# Altium project EasyARM-i.MX283-EV.PrjPcb (part 2 of 2)

## Sheet 10. TF Card.SchDoc
size A4; CheckedBy: 黄钦宁; Author: 陈坤; DocumentNumber: 10; SheetNumber: 10; SheetTotal: 13; PageSetup: Record=PageOptions|CenterHorizontal=True|CenterVertical=True|PrintScale=1.00|XCorrection=1.00|YCorrection=1.00|PrintKind=0|BorderSize=5000000|LeftOffset=0|BottomOffset=0|Orientation=2|PaperLength=1000|PaperWidth=1000|Scale=100|PaperSource=7|PrintQuality=600|MediaType=1|DitherType=10|PaperKind=A4|PrintScaleMode=1; DesignDate: 2013-08-16; CheckDate: 2013-12-28; SheetName: TF Card; SheetVersion: V1.00; SheetDescription: TF卡接口; ModifiedDate1: 2013-11-30; ModifiedContent1: 将上拉电阻改为分立电阻，方便调试; ProductName: EasyARM-iMX28学习套件; ProductModel: EasyARM-iMX283
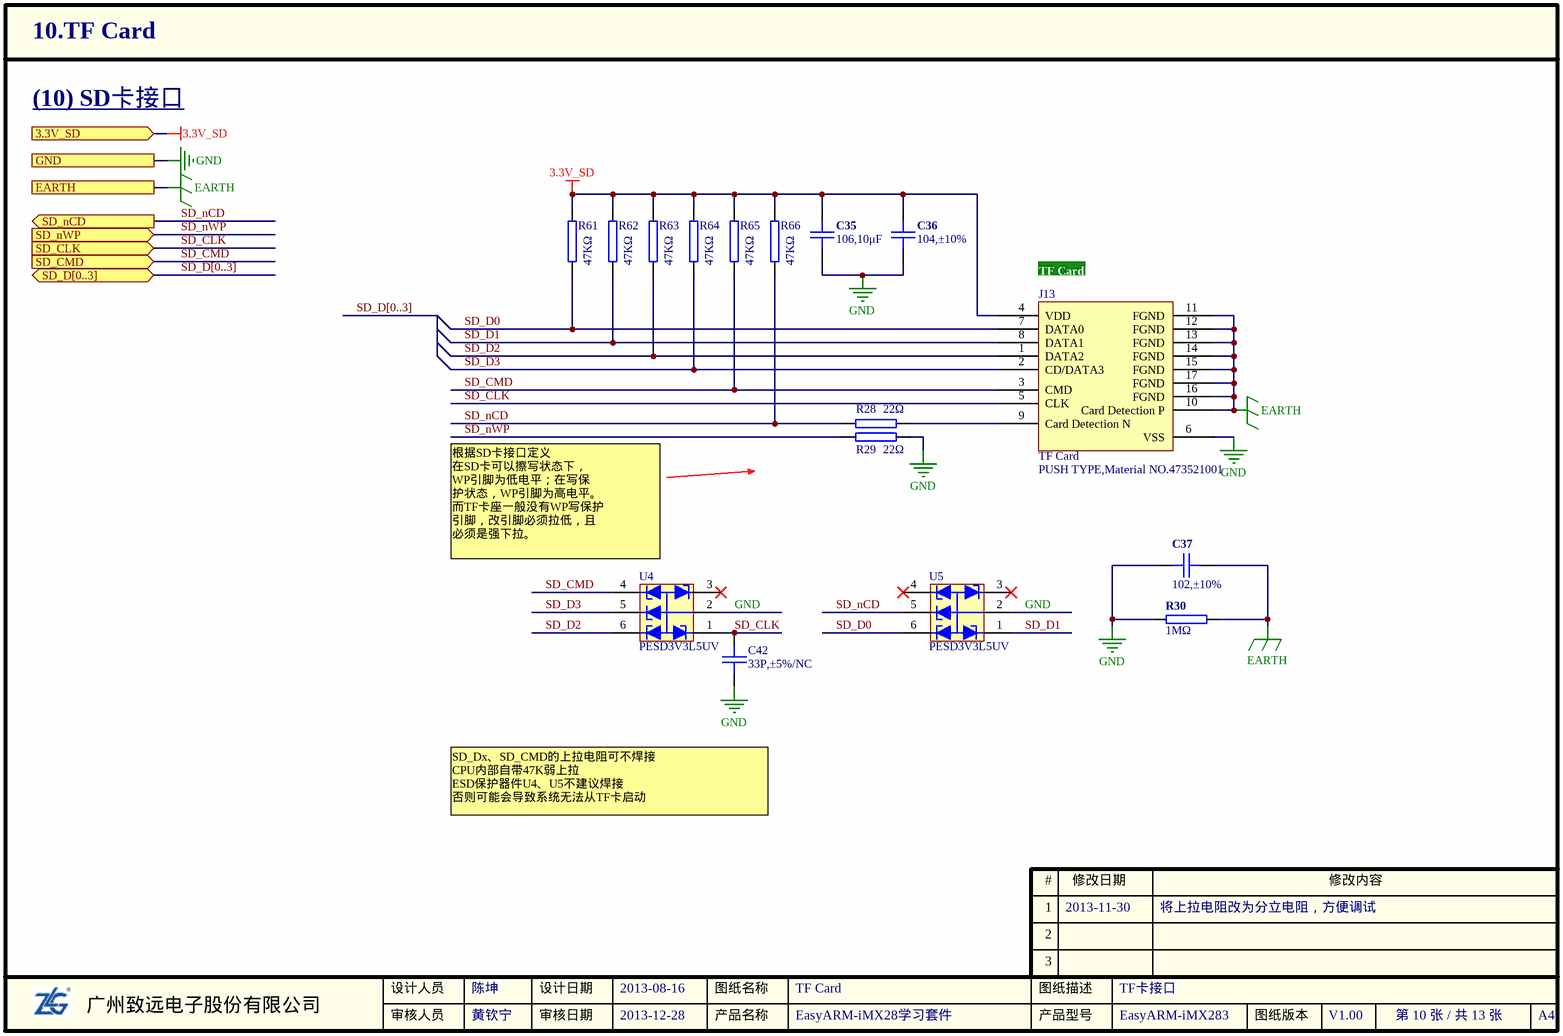
[diagram p7: 10. TF Card.SchDoc]

### Parts
C35  106,10μF  [0805C]
C36  104,±10%  [0603C]
C37  102,±10%  [1206C]
C42  33P,±5%/NC  [0603C]
J13  TF Card  value PUSH TYPE,Material NO.473521001  [TF-MOLEX_a]
R28  22Ω  [0603R]
R29  22Ω  [0603R]
R30  1MΩ  [1206R]
R61  47KΩ  [0603R]
R62  47KΩ  [0603R]
R63  47KΩ  [0603R]
R64  47KΩ  [0603R]
R65  47KΩ  [0603R]
R66  47KΩ  [0603R]
U4  value PESD3V3L5UV  [SOT-666]  (hidden comment: PESD5V0L5UV)
U5  value PESD3V3L5UV  [SOT-666]  (hidden comment: PESD5V0L5UV)

### Ports
3.3V_SD, EARTH, GND, SD_CLK (in), SD_CMD (in), SD_D[0..3] (bidir), SD_nCD (out), SD_nWP (in)

### Nets
3.3V_SD: C35.1 C36.1 J13.4(VDD) R61.2 R62.2 R63.2 R64.2 R65.2 R66.2 ; port 3.3V_SD  [project net 3.3V]
EARTH: C37.1 J13.10(Card_Detection_P) J13.11(FGND) J13.12(FGND) J13.13(FGND) J13.14(FGND) J13.15(FGND) J13.16(FGND) J13.17(FGND) R30.1 ; port EARTH
GND: C35.2 C36.2 C37.2 C42.2 J13.6(VSS) R29.1 R30.2 U4.2 U5.2 ; port GND
SD_CLK: C42.1 J13.5(CLK) U4.1 ; port SD_CLK
SD_CMD: J13.3(CMD) R65.1 U4.4 ; port SD_CMD
SD_D0: J13.7(DATA0) R61.1 U5.6
SD_D1: J13.8(DATA1) R62.1 U5.1
SD_D2: J13.1(DATA2) R63.1 U4.6
SD_D3: J13.2(CD/DATA3) R64.1 U4.5
SD_nCD: R28.1 R66.1 U5.5 ; port SD_nCD  [project net SD_DETECT]
SD_nWP: R29.2 ; port SD_nWP
NetJ13_9: J13.9(Card_Detection_N) R28.2

Not connected (* = marked no-connect by the designer): U4 3*; U5 3* 4*

### Buses and harness runs
bus SD_D[0..3]
bus SD_D[0..3] = port SD_D[0..3]

### Notes on the sheet
- (10) SD卡接口
- (near J13) TF Card
- (near U4) 根据SD卡接口定义
  在SD卡可以擦写状态下，
  WP引脚为低电平；在写保
  护状态，WP引脚为高电平。
  而TF卡座一般没有WP写保护
  引脚，改引脚必须拉低，且
  必须是强下拉。
- SD_Dx、SD_CMD的上拉电阻可不焊接
  CPU内部自带47K弱上拉
  ESD保护器件U4、U5不建议焊接
  否则可能会导致系统无法从TF卡启动
- 1
- #
- 修改日期
- 修改内容
- 2
- 3
- 广州致远电子股份有限公司
- 设计人员
- 审核人员
- 设计日期
- 审核日期
- 产品名称
- 图纸名称
- 产品型号
- 图纸描述
- 图纸版本
- A4

### Library data of the parts
C35 = 1.02.02.0055: as C43 on sheet 08. NET_DP83848K; 物料代码: 1.02.02.0055; Value: 106,10μF; RoHS: RoHS; 型号: 106,10μF,±10%,10V,X5R; ComponentLink1Description: ErpDataInfo; ComponentLink1URL: http://erp.zlgmcu.com/ErpExt/ErpData/ListMateriel.aspx?pkey=1.02.02.0055
C36 = 1.02.01.0032: as C12 on sheet 05. UART; 物料代码: 1.02.01.0032; Value: 104,±10%; RoHS: RoHS; 型号: 104,±10%,50V,X7R; ComponentLink1Description: ErpDataInfo; ComponentLink1URL: http://erp.zlgmcu.com/ErpExt/ErpData/ListMateriel.aspx?pkey=1.02.01.0032
C37 = 1.02.03.0003: Capacitor; 名称: 电容; 规格型号: 102,±10%,2KV,X7R,1206,*,RoHS; 现有库存: 26517; 封装: 1206; 设备封装名称: C1206_102_X7R_2KV_10%; 贴片和直插: SMT; 物料代码: 1.02.03.0003; Value: 102,±10%; ComponentLink1Description: ErpDataInfo; ComponentLink1URL: http://erp.zlgmcu.com/ErpExt/ErpData/ListMateriel.aspx?pkey=1.02.03.0003; RoHS: RoHS
C42 = 1.02.01.0045: 33P,±5%,50V,COG,0603,RoHS; 名称: 电容; 封装: 0603; 设备封装名称: C0603_33P_COG_50V_5%; 贴片和直插: SMT; 物料代码: 1.02.01.0045; Value: 33P,±5%/NC; RoHS: RoHS; 型号: 33P,±5%,50V,COG; ComponentLink1Description: ErpDataInfo; ComponentLink1URL: http://erp.zlgmcu.com/ErpExt/ErpData/ListMateriel.aspx?pkey=1.02.01.0045
J13 = 1.10.05.0147: PUSH TYPE,Material NO.473521001,15.2×14×1.88mm,molex,RoHS; 名称: TF卡座; 贴片和直插: SMT; 物料代码: 1.10.05.0147; 厂商: molex; RoHS: RoHS; 型号: PUSH TYPE,Material NO.473521001,15.2×14×1.88mm; ComponentLink1Description: ErpDataInfo; ComponentLink1URL: http://erp.zlgmcu.com/ErpExt/ErpData/ListMateriel.aspx?pkey=1.10.05.0147
R28 R29 = 1.01.01.0014: 名称: 电阻; 规格型号: 22Ω,0603,*,RoHS; 现有库存: 99098; 物料代码: 1.01.01.0014; Value: 22Ω; ComponentLink1Description: ErpDataInfo; ComponentLink1URL: http://192.168.0.2:8012/ErpExt/ErpData/ListMateriel.aspx?pkey=1.01.01.0014
R30 = 1.01.03.0019: 名称: 电阻; 规格型号: 1MΩ,1206,RoHS; 现有库存: 12252; 封装: 1206; 设备封装名称: R1206_1M; 贴片和直插: SMT; 物料代码: 1.01.03.0019; Value: 1MΩ; ComponentLink1Description: ErpDataInfo; ComponentLink1URL: http://erp.zlgmcu.com/ErpExt/ErpData/ListMateriel.aspx?pkey=1.01.03.0019; RoHS: RoHS
R61-R66 = 1.01.01.0060: 47KΩ,0603,*,RoHS; 名称: 电阻; 封装: 0603; 设备封装名称: R0603_47K; 贴片和直插: SMT; 物料代码: 1.01.01.0060; Value: 47KΩ; RoHS: RoHS; 型号: 47KΩ; ComponentLink1Description: ErpDataInfo; ComponentLink1URL: http://erp.zlgmcu.com/ErpExt/ErpData/ListMateriel.aspx?pkey=1.01.01.0060
U4 U5 = 1.05.10.0315: PESD3V3L5UV,SOT-666,NXP,RoHS; 名称: IC; 设备封装名称: SOT-666_PESD3V3L5UV; 贴片和直插: SMT; 物料代码: 1.05.10.0315; 封装: SOT-666; 厂商: NXP; RoHS: RoHS; 型号: PESD3V3L5UV; ComponentLink1Description: ErpDataInfo; ComponentLink1URL: http://erp.zlgmcu.com/ErpExt/ErpData/ListMateriel.aspx?pkey=1.05.10.0315

## Sheet 11. LCD.SchDoc
size A4; CheckedBy: 黄钦宁; Author: 陈坤; DocumentNumber: 11; SheetNumber: 11; SheetTotal: 13; PageSetup: Record=PageOptions|CenterHorizontal=True|CenterVertical=True|PrintScale=1.00|XCorrection=1.00|YCorrection=1.00|PrintKind=0|BorderSize=5000000|LeftOffset=0|BottomOffset=0|Orientation=2|PaperLength=1000|PaperWidth=1000|Scale=100|PaperSource=7|PrintQuality=600|MediaType=1|DitherType=10|PaperKind=A4|PrintScaleMode=1; DesignDate: 2013-08-16; CheckDate: 2013-12-28; SheetName: LCD; SheetVersion: V1.00; SheetDescription: 液晶屏接口; ProductName: EasyARM-iMX28学习套件; ProductModel: EasyARM-iMX283
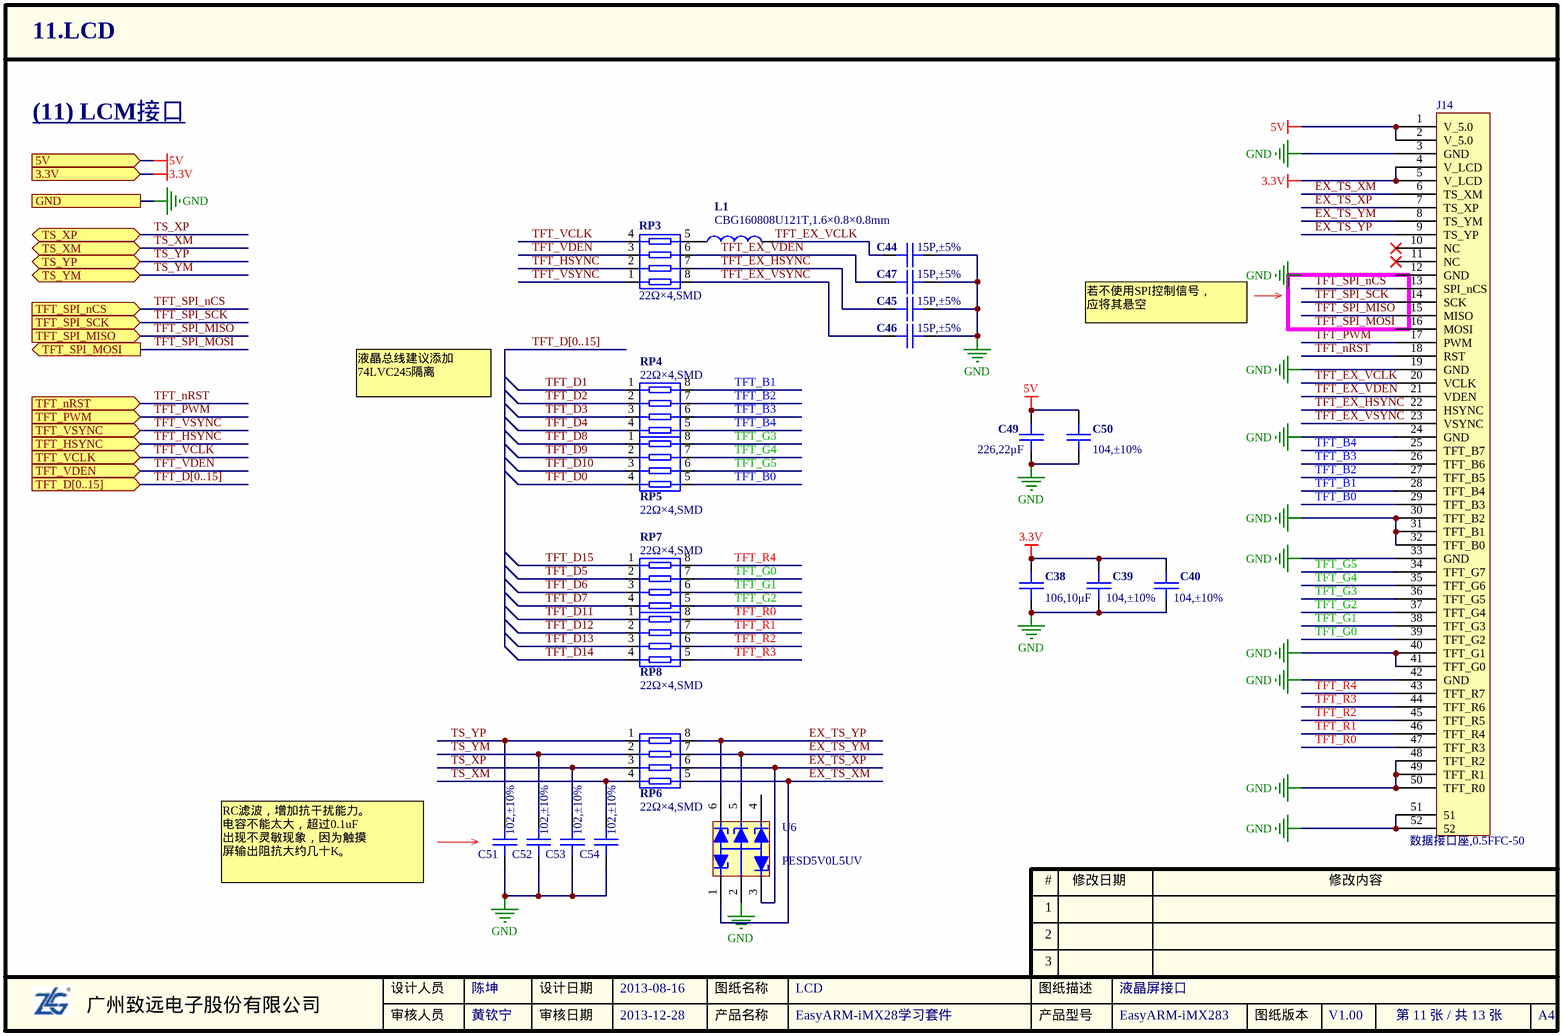
[diagram p8: 11. LCD.SchDoc]

### Parts
C38  106,10μF  [0805C]
C39  104,±10%  [0603C]
C40  104,±10%  [0603C]
C44  15P,±5%  [0603C]
C45  15P,±5%  [0603C]
C46  15P,±5%  [0603C]
C47  15P,±5%  [0603C]
C49  226,22μF  [0805C]
C50  104,±10%  [0603C]
C51  102,±10%  [0603C]
C52  102,±10%  [0603C]
C53  102,±10%  [0603C]
C54  102,±10%  [0603C]
J14  value 数据接口座,0.5FFC-50  [FFC0.5-50P-A]  (hidden comment: FPC-50)
L1  value CBG160808U121T,1.6×0.8×0.8mm  [0603R]  (hidden comment: INDUCTOR1)
RP3  22Ω×4,SMD  [0603RA]
RP4  22Ω×4,SMD  [0603RA]
RP5  22Ω×4,SMD  [0603RA]
RP6  22Ω×4,SMD  [0603RA]
RP7  22Ω×4,SMD  [0603RA]
RP8  22Ω×4,SMD  [0603RA]
U6  PESD5V0L5UV  [SOT-666]

### Ports
3.3V, 5V, GND, TFT_D[0..15] (in), TFT_HSYNC (in), TFT_nRST (in), TFT_PWM (in), TFT_SPI_MISO (in), TFT_SPI_MOSI (out), TFT_SPI_nCS (in), TFT_SPI_SCK (in), TFT_VCLK (in), TFT_VDEN (in), TFT_VSYNC (in), TS_XM (bidir), TS_XP (bidir), TS_YM (bidir), TS_YP (bidir)

### Nets
3.3V: C38.1 C39.1 C40.1 J14.4(V_LCD) J14.5(V_LCD) ; port 3.3V
5V: C49.1 C50.1 J14.1(V_5.0) J14.2(V_5.0) ; port 5V
GND: C38.2 C39.2 C40.2 C44.2 C45.2 C46.2 C47.2 C49.2 C50.2 C51.2 C52.2 C53.2 C54.2 J14.3(GND) J14.12(GND) J14.19(GND) J14.24(GND) J14.30(TFT_B2) J14.31(TFT_B1) J14.32(TFT_B0) J14.33(GND) J14.40(TFT_G1) J14.41(TFT_G0) J14.42(GND) J14.48(TFT_R2) J14.49(TFT_R1) J14.50(TFT_R0) J14.51 J14.52 U6.2 ; port GND
EX_TS_XM: J14.6(TS_XM) RP6.5 U6.1
EX_TS_XP: J14.7(TS_XP) RP6.6 U6.3
EX_TS_YM: J14.8(TS_YM) RP6.7 U6.5
EX_TS_YP: J14.9(TS_YP) RP6.8 U6.6
TFT_B0: J14.29(TFT_B3) RP5.5
TFT_B1: J14.28(TFT_B4) RP4.8
TFT_B2: J14.27(TFT_B5) RP4.7
TFT_B3: J14.26(TFT_B6) RP4.6
TFT_B4: J14.25(TFT_B7) RP4.5
TFT_D0: RP5.4
TFT_D1: RP4.1
TFT_D2: RP4.2
TFT_D3: RP4.3
TFT_D4: RP4.4
TFT_D5: RP7.2
TFT_D6: RP7.3
TFT_D7: RP7.4
TFT_D8: RP5.1
TFT_D9: RP5.2
TFT_D10: RP5.3
TFT_D11: RP8.1
TFT_D12: RP8.2
TFT_D13: RP8.3
TFT_D14: RP8.4
TFT_D15: RP7.1
TFT_EX_HSYNC: C45.1 J14.22(HSYNC) RP3.7
TFT_EX_VCLK: C44.1 J14.20(VCLK) L1.2
TFT_EX_VDEN: C47.1 J14.21(VDEN) RP3.6
TFT_EX_VSYNC: C46.1 J14.23(VSYNC) RP3.8
TFT_G0: J14.39(TFT_G2) RP7.7
TFT_G1: J14.38(TFT_G3) RP7.6
TFT_G2: J14.37(TFT_G4) RP7.5
TFT_G3: J14.36(TFT_G5) RP5.8
TFT_G4: J14.35(TFT_G6) RP5.7
TFT_G5: J14.34(TFT_G7) RP5.6
TFT_HSYNC: RP3.2 ; port TFT_HSYNC
TFT_nRST: J14.18(RST) ; port TFT_nRST
TFT_PWM: J14.17(PWM) ; port TFT_PWM
TFT_R0: J14.47(TFT_R3) RP8.8
TFT_R1: J14.46(TFT_R4) RP8.7
TFT_R2: J14.45(TFT_R5) RP8.6
TFT_R3: J14.44(TFT_R6) RP8.5
TFT_R4: J14.43(TFT_R7) RP7.8
TFT_SPI_MISO: J14.15(MISO) ; port TFT_SPI_MISO
TFT_SPI_MOSI: J14.16(MOSI) ; port TFT_SPI_MOSI
TFT_SPI_nCS: J14.13(SPI_nCS) ; port TFT_SPI_nCS
TFT_SPI_SCK: J14.14(SCK) ; port TFT_SPI_SCK
TFT_VCLK: RP3.4 ; port TFT_VCLK
TFT_VDEN: RP3.3 ; port TFT_VDEN
TFT_VSYNC: RP3.1 ; port TFT_VSYNC
TS_XM: C54.1 RP6.4 ; port TS_XM
TS_XP: C53.1 RP6.3 ; port TS_XP
TS_YM: C52.1 RP6.2 ; port TS_YM
TS_YP: C51.1 RP6.1 ; port TS_YP
NetL1_1: L1.1 RP3.5

Not connected (* = marked no-connect by the designer): J14 10(NC)* 11(NC)*; U6 4

### Buses and harness runs
bus TFT_D[0..15]
bus TFT_D[0..15] = port TFT_D[0..15]

### Notes on the sheet
- (11) LCM接口
- 若不使用SPI控制信号，
  应将其悬空
- 液晶总线建议添加
  74LVC245隔离
- RC滤波，增加抗干扰能力。
  电容不能太大，超过0.1uF
  出现不灵敏现象，因为触摸
  屏输出阻抗大约几十K。
- 1
- #
- 修改日期
- 修改内容
- 2
- 3
- 广州致远电子股份有限公司
- 设计人员
- 审核人员
- 设计日期
- 审核日期
- 产品名称
- 图纸名称
- 产品型号
- 图纸描述
- 图纸版本
- A4

### Library data of the parts
C38 = 1.02.02.0055: as C43 on sheet 08. NET_DP83848K; 物料代码: 1.02.02.0055; Value: 106,10μF; RoHS: RoHS; 型号: 106,10μF,±10%,10V,X5R; ComponentLink1Description: ErpDataInfo; ComponentLink1URL: http://erp.zlgmcu.com/ErpExt/ErpData/ListMateriel.aspx?pkey=1.02.02.0055
C39 C40 C50 = 1.02.01.0032: as C12 on sheet 05. UART; 物料代码: 1.02.01.0032; Value: 104,±10%; RoHS: RoHS; 型号: 104,±10%,50V,X7R; ComponentLink1Description: ErpDataInfo; ComponentLink1URL: http://erp.zlgmcu.com/ErpExt/ErpData/ListMateriel.aspx?pkey=1.02.01.0032
C44-C47 = 1.02.01.0002: 15P,±5%,50V,COG,0603,*,RoHS; 名称: 电容; 封装: 0603; 设备封装名称: C0603_15P_COG_50V_5%; 贴片和直插: SMT; 物料代码: 1.02.01.0002; Value: 15P,±5%; RoHS: RoHS; 型号: 15P,±5%,50V,COG; ComponentLink1Description: ErpDataInfo; ComponentLink1URL: http://erp.zlgmcu.com/ErpExt/ErpData/ListMateriel.aspx?pkey=1.02.01.0002
C49 = 1.02.02.0059: as C64 on sheet 08. NET_DP83848K; 物料代码: 1.02.02.0059; Value: 226,22μF; RoHS: RoHS; 型号: 226,22μF,±20%,6.3V,X5R; ComponentLink1Description: ErpDataInfo; ComponentLink1URL: http://erp.zlgmcu.com/ErpExt/ErpData/ListMateriel.aspx?pkey=1.02.02.0059
C51-C54 = 1.02.01.0020: 102,±10%,50V,X7R,0603,*,RoHS; 名称: 电容; 封装: 0603; 设备封装名称: C0603_102_X7R_50V_10%; 贴片和直插: SMT; 物料代码: 1.02.01.0020; Value: 102,±10%; RoHS: RoHS; 型号: 102,±10%,50V,X7R; ComponentLink1Description: ErpDataInfo; ComponentLink1URL: http://erp.zlgmcu.com/ErpExt/ErpData/ListMateriel.aspx?pkey=1.02.01.0020
J14 = 1.10.01.0028: 数据接口座,0.5FFC-50,SMD,下接,RoHS; 名称: 连接器-SMD; 贴片和直插: SMT; 物料代码: 1.10.01.0028; RoHS: RoHS; 型号: 数据接口座,0.5FFC-50,SMD,下接; ComponentLink1Description: ErpDataInfo; ComponentLink1URL: http://erp.zlgmcu.com/ErpExt/ErpData/ListMateriel.aspx?pkey=1.10.01.0028
L1 = 1.03.03.0007: CBG160808U121T,1.6×0.8×0.8mm,0603,RoHS; 名称: 磁珠; 封装: 0603; 设备封装名称: FB0603_121T; 贴片和直插: SMT; 物料代码: 1.03.03.0007; RoHS: RoHS; 型号: CBG160808U121T,1.6×0.8×0.8mm; ComponentLink1Description: ErpDataInfo; ComponentLink1URL: http://erp.zlgmcu.com/ErpExt/ErpData/ListMateriel.aspx?pkey=1.03.03.0007
RP3-RP8 = 1.01.04.0001: 名称: 网络电阻; 规格型号: 22Ω×4,SMD,PZ-4-0.8,RoHS; 现有库存: 85384; 封装: PZ-4-0.8; 设备封装名称: 22R_4_0603; 贴片和直插: SMT; 物料代码: 1.01.04.0001; Value: 22Ω×4,SMD; ComponentLink1Description: ErpDataInfo; ComponentLink1URL: http://erp.zlgmcu.com/ErpExt/ErpData/ListMateriel.aspx?pkey=1.01.04.0001; RoHS: RoHS
U6 = 1.05.10.0189: PESD5V0L5UV,SOT-666,NXP,RoHS; 名称: IC; 设备封装名称: SOT-666_PESD5V0L5UV; 贴片和直插: SMT; 物料代码: 1.05.10.0189; Value: PESD5V0L5UV; 封装: SOT-666; 厂商: NXP; RoHS: RoHS; 型号: PESD5V0L5UV; ComponentLink1Description: ErpDataInfo; ComponentLink1URL: http://erp.zlgmcu.com/ErpExt/ErpData/ListMateriel.aspx?pkey=1.05.10.0189

## Sheet 03. Power.SchDoc
size A4; CheckedBy: 黄钦宁; Author: 陈坤; DocumentNumber: 3; SheetNumber: 3; SheetTotal: 13; PageSetup: Record=PageOptions|CenterHorizontal=True|CenterVertical=True|PrintScale=1.00|XCorrection=1.00|YCorrection=1.00|PrintKind=0|BorderSize=5000000|LeftOffset=0|BottomOffset=0|Orientation=2|PaperLength=1000|PaperWidth=1000|Scale=100|PaperSource=7|PrintQuality=600|MediaType=1|DitherType=10|PaperKind=A4|PrintScaleMode=1; DesignDate: 2013-08-16; CheckDate: 2013-12-28; SheetName: Power; SheetVersion: V1.00; SheetDescription: 评估板电源，包括1路5V，1路3.3V; ProductModel: EasyARM-iMX283; ProductName: EasyARM-iMX28学习套件
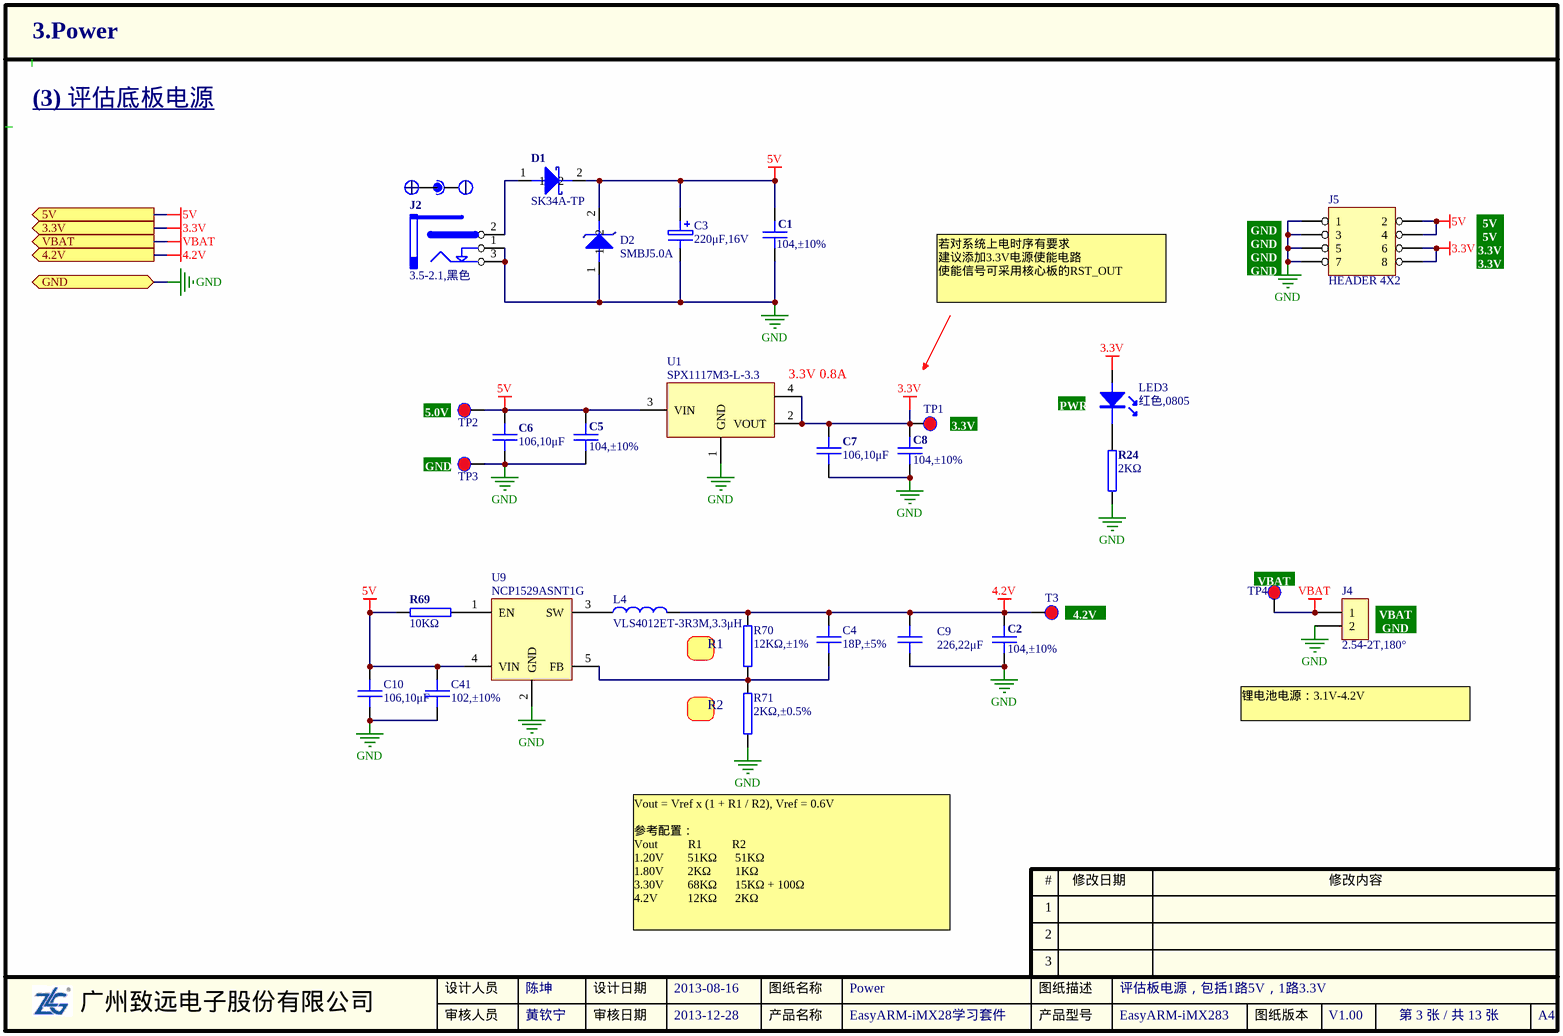
[diagram p9: 03. Power.SchDoc]

### Parts
C1  104,±10%  [0603C]
C2  104,±10%  [0603C]
C3  220μF,16V  [RB-.1/.25]
C4  18P,±5%  [0603C]
C5  104,±10%  [0603C]
C6  106,10μF  [0805C]
C7  106,10μF  [0805C]
C8  104,±10%  [0603C]
C9  226,22μF  [0805C]
C10  106,10μF  [0805C]
C41  102,±10%  [0603C]
D1  value SK34A-TP  [SOD-SK34A]  (hidden comment: DIODE SCHOTTKY)
D2  value SMBJ5.0A  [1812D]  (hidden comment: DIODE ZENER)
J2  value 3.5-2.1,黑色  [POWER-AC]  (hidden comment: POWER-COM)
J4  value 2.54-2T,180°  [CN-2-2.54]  (hidden comment: CON2)
J5  HEADER 4X2  [IDC-8]
L4  value VLS4012ET-3R3M,3.3μH  [L-4.0S-VLS]  (hidden comment: INDUCTOR1)
LED3  value 红色,0805  [LED-0805]  (hidden comment: LED1)
R24  2KΩ  [0603R]
R69  10KΩ  [0603R]
R70  12KΩ,±1%  [0603R]
R71  2KΩ,±0.5%  [0603R]
T3  4.2V  [PAD-40]  (value not drawn)
TP1  3.3V  [PAD-40]  (value not drawn)
TP2  5.0V  [PAD-40]  (value not drawn)
TP3  GND  [PAD-40]  (value not drawn)
TP4  VBAT  [PAD-40]  (value not drawn)
U1  value SPX1117M3-L-3.3  [SOT-223]  (hidden comment: SPX1117M3-L/TR)
U9  value NCP1529ASNT1G  [SOT-23-5]  (hidden comment: SCY99090SNT1G)

### Ports
3.3V, 4.2V (out), 5V (out), GND, VBAT (out)

### Nets
3.3V: C7.1 C8.1 J5.6 J5.8 LED3.1 TP1.1 U1.2(VOUT) U1.4 ; port 3.3V
4.2V: C2.1 C4.1 C9.1 L4.2 R70.2 T3.1 ; port 4.2V
5V: C1.1 C3.1 C5.1 C6.1 C10.1 C41.1 D1.2 D2.2 J5.2 J5.4 R69.1 TP2.1 U1.3(VIN) U9.4(VIN) ; port 5V
GND: C1.2 C2.2 C3.2 C5.2 C6.2 C7.2 C8.2 C9.2 C10.2 C41.2 D2.1 J2.1(A) J2.3(B) J4.2 J5.1 J5.3 J5.5 J5.7 R24.1 R71.1 TP3.1 U1.1(GND) U9.2(GND) ; port GND
VBAT: J4.1 TP4.1 ; port VBAT
NetC4_2: C4.2 R70.1 R71.2 U9.5(FB)
NetD1_1: D1.1 J2.2(B)
NetL4_1: L4.1 U9.3(SW)
NetLED3_2: LED3.2 R24.2
NetR69_2: R69.2 U9.1(EN)

### Notes on the sheet
- (3) 评估底板电源
- (near J5) GND
- 5V
- 3.3V
- 若对系统上电时序有要求
  建议添加3.3V电源使能电路
  使能信号可采用核心板的RST_OUT
- (near U1) 3.3V 0.8A
- (near TP2) 5.0V
- (near LED3) PWR
- (near TP3) GND
- (near TP4) VBAT
- R1
- (near T3) 4.2V
- (near J4) VBAT
- (near J4) GND
- R2
- 锂电池电源：3.1V-4.2V
- Vout = Vref x (1 + R1 / R2), Vref = 0.6V
  参考配置：
  Vout          R1          R2
  1.20V        51KΩ      51KΩ
  1.80V        2KΩ        1KΩ
  3.30V        68KΩ      15KΩ + 100Ω
  4.2V          12KΩ      2KΩ
- 1
- #
- 修改日期
- 修改内容
- 2
- 3
- 广州致远电子股份有限公司
- 设计人员
- 审核人员
- 设计日期
- 审核日期
- 产品名称
- 图纸名称
- 产品型号
- 图纸描述
- 图纸版本
- A4

### Library data of the parts
C1 C2 C5 C8 = 1.02.01.0032: 104,±10%,50V,X7R,0603,*,RoHS; 名称: 电容; 封装: 0603; 设备封装名称: C0603_104_X7R_50V_10%; 贴片和直插: SMT; 器件优选方案: 优先选用; 物料代码: 1.02.01.0032; Value: 104,±10%; RoHS: RoHS; 型号: 104,±10%,50V,X7R; ComponentLink1Description: ErpDataInfo; ComponentLink1URL: http://erp.zlgmcu.com/ErpExt/ErpData/ListMateriel.aspx?pkey=1.02.01.0032
C3 = 1.02.11.0018: 220μF,16V,Ф6.3×7mm,,珠海华冠,RoHS; 名称: 电解电容; 贴片和直插: THT; 物料代码: 1.02.11.0018; Value: 220μF,16V; 厂商: 珠海华冠; RoHS: RoHS; 型号: 220μF,16V,Ф6.3×7mm; ComponentLink1Description: ErpDataInfo; ComponentLink1URL: http://erp.zlgmcu.com/ErpExt/ErpData/ListMateriel.aspx?pkey=1.02.11.0018
C4 = 1.02.01.0003: 18P,±5%,50V,COG,0603,*,RoHS; 名称: 电容; 封装: 0603; 设备封装名称: C0603_18P_COG_50V_5%; 贴片和直插: SMT; 物料代码: 1.02.01.0003; Value: 18P,±5%; RoHS: RoHS; 型号: 18P,±5%,50V,COG; ComponentLink1Description: ErpDataInfo; ComponentLink1URL: http://erp.zlgmcu.com/ErpExt/ErpData/ListMateriel.aspx?pkey=1.02.01.0003
C6 C7 C10 = 1.02.02.0055: 106,10μF,±10%,10V,X5R,0805,RoHS; 名称: 电容; 封装: 0805; 设备封装名称: C0805_106_X5R_10V_10%; 贴片和直插: SMT; 物料代码: 1.02.02.0055; Value: 106,10μF; RoHS: RoHS; 型号: 106,10μF,±10%,10V,X5R; ComponentLink1Description: ErpDataInfo; ComponentLink1URL: http://erp.zlgmcu.com/ErpExt/ErpData/ListMateriel.aspx?pkey=1.02.02.0055
C9 = 1.02.02.0059: 226,22μF,±20%,6.3V,X5R,0805,RoHS; 名称: 电容; 封装: 0805; 设备封装名称: C0805_226_X5R_6.3V_20%; 贴片和直插: SMT; 物料代码: 1.02.02.0059; Value: 226,22μF; RoHS: RoHS; 型号: 226,22μF,±20%,6.3V,X5R; ComponentLink1Description: ErpDataInfo; ComponentLink1URL: http://erp.zlgmcu.com/ErpExt/ErpData/ListMateriel.aspx?pkey=1.02.02.0059
C41 = 1.02.01.0020: 102,±10%,50V,X7R,0603,*,RoHS; 名称: 电容; 封装: 0603; 设备封装名称: C0603_102_X7R_50V_10%; 贴片和直插: SMT; 物料代码: 1.02.01.0020; Value: 102,±10%; RoHS: RoHS; 型号: 102,±10%,50V,X7R; ComponentLink1Description: ErpDataInfo; ComponentLink1URL: http://erp.zlgmcu.com/ErpExt/ErpData/ListMateriel.aspx?pkey=1.02.01.0020
D1 = 1.04.07.0021: SK34A-TP,DO-214AC,MCC,RoHS; 名称: 二极管; 设备封装名称: DO-214AC_SK34A; 贴片和直插: SMT; 物料代码: 1.04.07.0021; 封装: DO-214AC; 厂商: MCC; RoHS: RoHS; 型号: SK34A-TP; ComponentLink1Description: ErpDataInfo; ComponentLink1URL: http://erp.zlgmcu.com/ErpExt/ErpData/ListMateriel.aspx?pkey=1.04.07.0021
D2 = 1.04.03.0001: SMBJ5.0A,DO-214AA,君耀,RoHS; 名称: TVS管; 设备封装名称: DO-214AA_SMBJ5.0A; 贴片和直插: SMT; 器件优选方案: 优先选用; 物料代码: 1.04.03.0001; 封装: DO-214AA; 厂商: 君耀; RoHS: RoHS; 型号: SMBJ5.0A; ComponentLink1Description: ErpDataInfo; ComponentLink1URL: http://erp.zlgmcu.com/ErpExt/ErpData/ListMateriel.aspx?pkey=1.04.03.0001
J2 = 1.10.05.0001: 3.5-2.1,黑色,RoHS; 名称: 电源座; 贴片和直插: THT; 物料代码: 1.10.05.0001; RoHS: RoHS; 型号: 3.5-2.1,黑色; ComponentLink1Description: ErpDataInfo; ComponentLink1URL: http://erp.zlgmcu.com/ErpExt/ErpData/ListMateriel.aspx?pkey=1.10.05.0001
J4 = 1.10.06.0009: 2.54-2T,180°,,*; 名称: 插座; 贴片和直插: THT; 物料代码: 1.10.06.0009; 型号: 2.54-2T,180°; ComponentLink1Description: ErpDataInfo; ComponentLink1URL: http://erp.zlgmcu.com/ErpExt/ErpData/ListMateriel.aspx?pkey=1.10.06.0009
L4 = 1.03.01.0155: VLS4012ET-3R3M,3.3μH,1.4A,SMD,TDK,RoHS; 名称: 电感; 贴片和直插: SMT; 物料代码: 1.03.01.0155; 封装: SMD; 厂商: TDK; RoHS: RoHS; 型号: VLS4012ET-3R3M,3.3μH,1.4A; ComponentLink1Description: ErpDataInfo; ComponentLink1URL: http://erp.zlgmcu.com/ErpExt/ErpData/ListMateriel.aspx?pkey=1.03.01.0155
LED3 = 1.04.05.0001: 红色,0805,0805,RoHS; 名称: 发光二极管; 封装: 0805; 设备封装名称: LED0805-RED; 贴片和直插: SMT; 器件优选方案: 优先选用; 物料代码: 1.04.05.0001; RoHS: RoHS; 型号: 红色,0805; ComponentLink1Description: ErpDataInfo; ComponentLink1URL: http://erp.zlgmcu.com/ErpExt/ErpData/ListMateriel.aspx?pkey=1.04.05.0001
R24 = 1.01.01.0038: 2KΩ,0603,*,RoHS; 名称: 电阻; 封装: 0603; 设备封装名称: R0603_2K; 贴片和直插: SMT; 物料代码: 1.01.01.0038; Value: 2KΩ; RoHS: RoHS; 型号: 2KΩ; ComponentLink1Description: ErpDataInfo; ComponentLink1URL: http://erp.zlgmcu.com/ErpExt/ErpData/ListMateriel.aspx?pkey=1.01.01.0038
R69 = 1.01.01.0051: 10KΩ,0603,*,RoHS; 名称: 电阻; 封装: 0603; 设备封装名称: R0603_10K; 贴片和直插: SMT; 物料代码: 1.01.01.0051; Value: 10KΩ; RoHS: RoHS; 型号: 10KΩ; ComponentLink1Description: ErpDataInfo; ComponentLink1URL: http://erp.zlgmcu.com/ErpExt/ErpData/ListMateriel.aspx?pkey=1.01.01.0051
R70 = 1.01.01.0053: 12KΩ,±1%,0603,*,RoHS; 名称: 电阻; 封装: 0603; 设备封装名称: R0603_12K_1%; 贴片和直插: SMT; 物料代码: 1.01.01.0053; Value: 12KΩ,±1%; RoHS: RoHS; 型号: 12KΩ,±1%; ComponentLink1Description: ErpDataInfo; ComponentLink1URL: http://erp.zlgmcu.com/ErpExt/ErpData/ListMateriel.aspx?pkey=1.01.01.0053
R71 = 1.01.01.0084: 2KΩ,±0.5%,0603,*,RoHS; 名称: 电阻; 封装: 0603; 设备封装名称: R0603_2K_0.5%; 贴片和直插: SMT; 物料代码: 1.01.01.0084; Value: 2KΩ,±0.5%; RoHS: RoHS; 型号: 2KΩ,±0.5%; ComponentLink1Description: ErpDataInfo; ComponentLink1URL: http://erp.zlgmcu.com/ErpExt/ErpData/ListMateriel.aspx?pkey=1.01.01.0084
T3 TP1-TP4 = TEST-DOT
U1 = 1.05.09.0025: SPX1117M3-L-3.3,SOT-223,EXAR,RoHS; 名称: IC; 设备封装名称: SOT-223_SPX1117M3-L-3.3; 贴片和直插: SMT; 物料代码: 1.05.09.0025; 封装: SOT-223; 厂商: EXAR; RoHS: RoHS; 型号: SPX1117M3-L-3.3; ComponentLink1Description: ErpDataInfo; ComponentLink1URL: http://erp.zlgmcu.com/ErpExt/ErpData/ListMateriel.aspx?pkey=1.05.09.0025
U9 = 1.05.09.0091: NCP1529ASNT1G,TSOP-5,ON,RoHS; 名称: IC; 设备封装名称: TSOP-5_NCP1529ASNT1G; 贴片和直插: SMT; 物料代码: 1.05.09.0091; 封装: TSOP-5; 厂商: ON; RoHS: RoHS; 型号: NCP1529ASNT1G; ComponentLink1Description: ErpDataInfo; ComponentLink1URL: http://erp.zlgmcu.com/ErpExt/ErpData/ListMateriel.aspx?pkey=1.05.09.0091

## Sheet 13. Others.SchDoc
size A4; CheckedBy: 黄钦宁; Author: 陈坤; DocumentNumber: 13; SheetNumber: 13; SheetTotal: 13; PageSetup: Record=PageOptions|CenterHorizontal=True|CenterVertical=True|PrintScale=1.00|XCorrection=1.00|YCorrection=1.00|PrintKind=0|BorderSize=5000000|LeftOffset=0|BottomOffset=0|Orientation=2|PaperLength=1000|PaperWidth=1000|Scale=100|PaperSource=7|PrintQuality=600|MediaType=1|DitherType=10|PaperKind=A4|PrintScaleMode=1; DesignDate: 2013-08-16; CheckDate: 2013-12-28; SheetName: Others; SheetVersion: V1.00; SheetDescription: 复位、模式配置、排针接口; ProductName: EasyARM-iMX28学习套件; ProductModel: EasyARM-iMX283
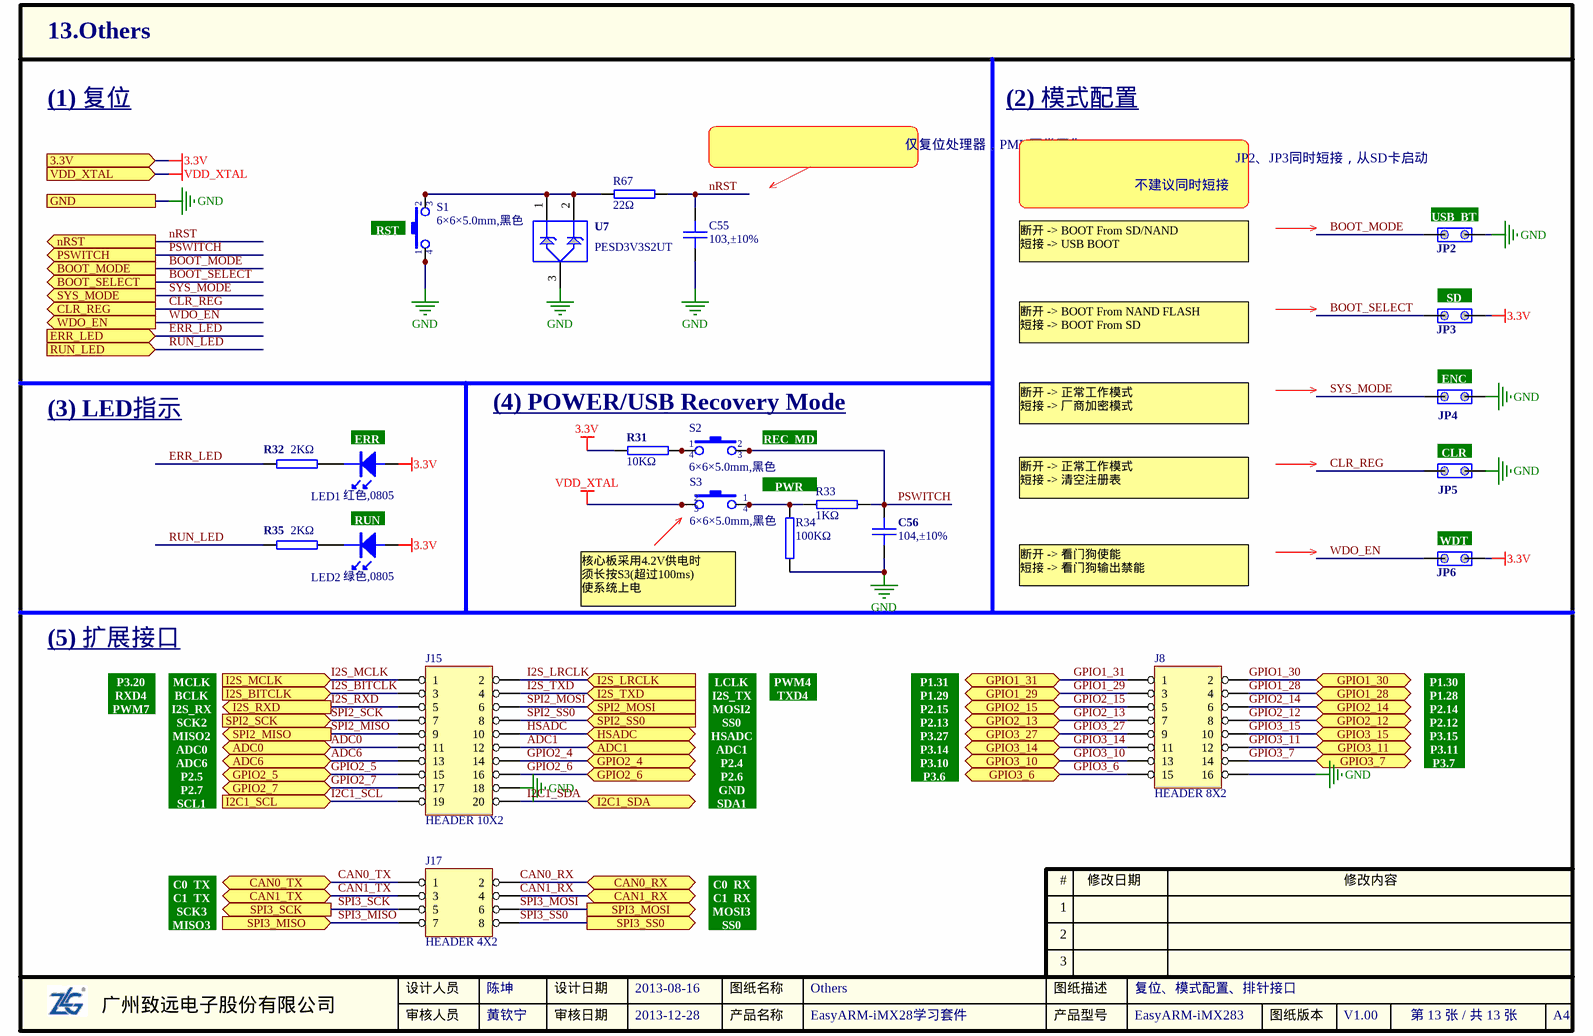
[diagram p10: 13. Others.SchDoc]

### Parts
C55  103,±10%  [0603C]
C56  104,±10%  [0603C]
J8  HEADER 8X2  [IDC-16]
J15  HEADER 10X2  [IDC-20]
J17  HEADER 4X2  [IDC-8]
JP2  120Ω_EN  [SIP-2]  (value not drawn)
JP3  120Ω_EN  [SIP-2]  (value not drawn)
JP4  120Ω_EN  [SIP-2]  (value not drawn)
JP5  120Ω_EN  [SIP-2]  (value not drawn)
JP6  120Ω_EN  [SIP-2]  (value not drawn)
LED1  value 红色,0805  [LED-0805]  (hidden comment: LED1)
LED2  value 绿色,0805  [LED-0805]  (hidden comment: LED1)
R31  10KΩ  [0603R]
R32  2KΩ  [0603R]
R33  1KΩ  [0603R]
R34  100KΩ  [0603R]
R35  2KΩ  [0603R]
R67  22Ω  [0603R]
S1  value 6×6×5.0mm,黑色  [KEY-6S]  (hidden comment: SW-PB4P)
S2  value 6×6×5.0mm,黑色  [KEY-6S]  (hidden comment: SW-PB4P)
S3  value 6×6×5.0mm,黑色  [KEY-6S]  (hidden comment: SW-PB4P)
U7  value PESD3V3S2UT  [SOT-23]  (hidden comment: ESD-3)

### Ports
3.3V, ADC0 (bidir), ADC1 (bidir), ADC6 (bidir), BOOT_MODE (out), BOOT_SELECT (out), CAN0_RX (bidir), CAN0_TX (bidir), CAN1_RX (bidir), CAN1_TX (bidir), CLR_REG (out), ERR_LED (in), GND, GPIO1_28 (bidir), GPIO1_29 (bidir), GPIO1_30 (bidir), GPIO1_31 (bidir), GPIO2_4 (bidir), GPIO2_5 (bidir), GPIO2_6 (bidir), GPIO2_7 (bidir), GPIO2_12 (bidir), GPIO2_13 (bidir), GPIO2_14 (bidir), GPIO2_15 (bidir), GPIO3_6 (bidir), GPIO3_7 (bidir), GPIO3_10 (bidir), GPIO3_11 (bidir), GPIO3_14 (bidir), GPIO3_15 (bidir), GPIO3_27 (bidir), HSADC (bidir), I2C1_SCL (in), I2C1_SDA (bidir), I2S_BITCLK (in), I2S_LRCLK (in), I2S_MCLK (in), I2S_RXD (out), I2S_TXD (in), nRST (out), PSWITCH (out), RUN_LED (in), SPI2_MISO (out), SPI2_MOSI (in), SPI2_SCK (in), SPI2_SS0 (in), SPI3_MISO (in), SPI3_MOSI (out), SPI3_SCK (out), SPI3_SS0 (out), SYS_MODE (out), VDD_XTAL (in), WDO_EN (out)

### Nets
3.3V: JP3.2 JP6.2 LED1.1 LED2.1 R31.1 ; port 3.3V
GND: C55.2 C56.1 J8.16 J15.18 JP2.2 JP4.2 JP5.2 R34.2 S1.1 S1.4 U7.3 ; port GND
VDD_XTAL: S3.2 S3.3 ; port VDD_XTAL
ADC0: J15.11 ; port ADC0
ADC1: J15.12 ; port ADC1
ADC6: J15.13 ; port ADC6
BOOT_MODE: JP2.1 ; port BOOT_MODE
BOOT_SELECT: JP3.1 ; port BOOT_SELECT
CAN0_RX: J17.2 ; port CAN0_RX
CAN0_TX: J17.1 ; port CAN0_TX
CAN1_RX: J17.4 ; port CAN1_RX
CAN1_TX: J17.3 ; port CAN1_TX
CLR_REG: JP5.1 ; port CLR_REG
ERR_LED: R32.1 ; port ERR_LED  [project net ERR]
GPIO1_28: J8.4 ; port GPIO1_28
GPIO1_29: J8.3 ; port GPIO1_29
GPIO1_30: J8.2 ; port GPIO1_30
GPIO1_31: J8.1 ; port GPIO1_31
GPIO2_4: J15.14 ; port GPIO2_4
GPIO2_5: J15.15 ; port GPIO2_5
GPIO2_6: J15.16 ; port GPIO2_6
GPIO2_7: J15.17 ; port GPIO2_7
GPIO2_12: J8.8 ; port GPIO2_12
GPIO2_13: J8.7 ; port GPIO2_13
GPIO2_14: J8.6 ; port GPIO2_14
GPIO2_15: J8.5 ; port GPIO2_15
GPIO3_6: J8.15 ; port GPIO3_6
GPIO3_7: J8.14 ; port GPIO3_7
GPIO3_10: J8.13 ; port GPIO3_10
GPIO3_11: J8.12 ; port GPIO3_11
GPIO3_14: J8.11 ; port GPIO3_14
GPIO3_15: J8.10 ; port GPIO3_15
GPIO3_27: J8.9 ; port GPIO3_27
HSADC: J15.10 ; port HSADC
I2C1_SCL: J15.19 ; port I2C1_SCL
I2C1_SDA: J15.20 ; port I2C1_SDA
I2S_BITCLK: J15.3 ; port I2S_BITCLK
I2S_LRCLK: J15.2 ; port I2S_LRCLK
I2S_MCLK: J15.1 ; port I2S_MCLK
I2S_RXD: J15.5 ; port I2S_RXD
I2S_TXD: J15.4 ; port I2S_TXD
nRST: C55.1 R67.1 ; port nRST
PSWITCH: C56.2 R33.2 S2.2 S2.3 ; port PSWITCH
RUN_LED: R35.1 ; port RUN_LED  [project net RUN]
SPI2_MISO: J15.9 ; port SPI2_MISO
SPI2_MOSI: J15.6 ; port SPI2_MOSI
SPI2_SCK: J15.7 ; port SPI2_SCK
SPI2_SS0: J15.8 ; port SPI2_SS0
SPI3_MISO: J17.7 ; port SPI3_MISO
SPI3_MOSI: J17.6 ; port SPI3_MOSI
SPI3_SCK: J17.5 ; port SPI3_SCK
SPI3_SS0: J17.8 ; port SPI3_SS0
SYS_MODE: JP4.1 ; port SYS_MODE  [project net Factory]
WDO_EN: JP6.1 ; port WDO_EN
NetLED1_2: LED1.2 R32.2
NetLED2_2: LED2.2 R35.2
NetR31_2: R31.2 S2.1 S2.4
NetR33_1: R33.1 R34.1 S3.1 S3.4
NetR67_2: R67.2 S1.2 S1.3 U7.1 U7.2

### Notes on the sheet
- (1) 复位
- (2) 模式配置
- 仅复位处理器，PMU正常工作
- JP2、JP3同时短接，从SD卡启动
- (near S1) RST
- 不建议同时短接
- (near JP2) USB_BT
- 断开 -> BOOT From SD/NAND
  短接 -> USB BOOT
- (near JP3) SD
- 断开 -> BOOT From NAND FLASH
  短接 -> BOOT From SD
- (near JP4) ENC
- (3) LED指示
- (near LED1) ERR
- (4) POWER/USB Recovery Mode
- (near S2) REC_MD
- 断开 -> 正常工作模式
  短接 -> 厂商加密模式
- (near LED2) RUN
- (near R33) PWR
- 断开 -> 正常工作模式
  短接 -> 清空注册表
- (near JP5) CLR
- 断开 -> 看门狗使能
  短接 -> 看门狗输出禁能
- (near JP6) WDT
- (5) 扩展接口
- 核心板采用4.2V供电时
  须长按S3(超过100ms)
  使系统上电
- P3.20
- RXD4
- PWM7
- MCLK
- BCLK
- I2S_RX
- MOSI2
- LCLK
- I2S_TX
- PWM4
- TXD4
- P1.31
- P1.29
- P2.15
- P1.30
- P1.28
- P2.14
- SCK2
- MISO2
- ADC0
- ADC6
- P2.5
- P2.7
- SS0
- HSADC
- ADC1
- P2.4
- P2.6
- GND
- P3.6
- P3.10
- P3.14
- P3.27
- P2.13
- P3.7
- P3.11
- P3.15
- P2.12
- SCL1
- SDA1
- C0_TX
- C1_TX
- SCK3
- MISO3
- C0_RX
- C1_RX
- MOSI3
- 1
- #
- 修改日期
- 修改内容
- 2
- 3
- 广州致远电子股份有限公司
- 设计人员
- 审核人员
- 设计日期
- 审核日期
- 产品名称
- 图纸名称
- 产品型号
- 图纸描述
- 图纸版本
- A4

### Library data of the parts
C55 = 1.02.01.0024: 103,±10%,50V,X7R,0603,*,RoHS; 名称: 电容; 封装: 0603; 设备封装名称: C0603_103_X7R_50V_10%; 贴片和直插: SMT; 物料代码: 1.02.01.0024; Value: 103,±10%; RoHS: RoHS; 型号: 103,±10%,50V,X7R; ComponentLink1Description: ErpDataInfo; ComponentLink1URL: http://erp.zlgmcu.com/ErpExt/ErpData/ListMateriel.aspx?pkey=1.02.01.0024
C56 = 1.02.01.0032: 104,±10%,50V,X7R,0603,*,RoHS; 名称: 电容; 封装: 0603; 设备封装名称: C0603_104_X7R_50V_10%; 贴片和直插: SMT; 物料代码: 1.02.01.0032; Value: 104,±10%; RoHS: RoHS; 型号: 104,±10%,50V,X7R; ComponentLink1Description: ErpDataInfo; ComponentLink1URL: http://erp.zlgmcu.com/ErpExt/ErpData/ListMateriel.aspx?pkey=1.02.01.0032
JP2-JP6 = JMP2
LED1 = 1.04.05.0001: as LED3 on sheet 03. Power; 物料代码: 1.04.05.0001; RoHS: RoHS; 型号: 红色,0805; ComponentLink1Description: ErpDataInfo; ComponentLink1URL: http://erp.zlgmcu.com/ErpExt/ErpData/ListMateriel.aspx?pkey=1.04.05.0001
LED2 = 1.04.05.0002: 绿色,0805,0805,RoHS; 名称: 发光二极管; 封装: 0805; 设备封装名称: LED0805-GREEN; 贴片和直插: SMT; 器件优选方案: 优先选用; 物料代码: 1.04.05.0002; RoHS: RoHS; 型号: 绿色,0805; ComponentLink1Description: ErpDataInfo; ComponentLink1URL: http://erp.zlgmcu.com/ErpExt/ErpData/ListMateriel.aspx?pkey=1.04.05.0002
R31 = 1.01.01.0051: as R69 on sheet 03. Power; 物料代码: 1.01.01.0051; Value: 10KΩ; RoHS: RoHS; 型号: 10KΩ; ComponentLink1Description: ErpDataInfo; ComponentLink1URL: http://erp.zlgmcu.com/ErpExt/ErpData/ListMateriel.aspx?pkey=1.01.01.0051
R32 R35 = 1.01.01.0038: as R24 on sheet 03. Power; 物料代码: 1.01.01.0038; Value: 2KΩ; RoHS: RoHS; 型号: 2KΩ; ComponentLink1Description: ErpDataInfo; ComponentLink1URL: http://erp.zlgmcu.com/ErpExt/ErpData/ListMateriel.aspx?pkey=1.01.01.0038
R33 = 1.01.01.0035: 1KΩ,0603,*,RoHS; 名称: 电阻; 封装: 0603; 设备封装名称: R0603_1K; 贴片和直插: SMT; 物料代码: 1.01.01.0035; Value: 1KΩ; RoHS: RoHS; 型号: 1KΩ; ComponentLink1Description: ErpDataInfo; ComponentLink1URL: http://erp.zlgmcu.com/ErpExt/ErpData/ListMateriel.aspx?pkey=1.01.01.0035
R34 = 1.01.01.0062: 100KΩ,0603,*,RoHS; 名称: 电阻; 封装: 0603; 设备封装名称: R0603_100K; 贴片和直插: SMT; 物料代码: 1.01.01.0062; Value: 100KΩ; RoHS: RoHS; 型号: 100KΩ; ComponentLink1Description: ErpDataInfo; ComponentLink1URL: http://erp.zlgmcu.com/ErpExt/ErpData/ListMateriel.aspx?pkey=1.01.01.0062
R67 = 1.01.01.0014: 名称: 电阻; 规格型号: 22Ω,0603,*,RoHS; 封装: 0603; 设备封装名称: R0603_22R; 贴片和直插: SMT; 物料代码: 1.01.01.0014; Value: 22Ω; RoHS: RoHS; ComponentLink1Description: ErpDataInfo; ComponentLink1URL: http://erp.zlgmcu.com/ErpExt/ErpData/ListMateriel.aspx?pkey=1.01.01.0014; 型号: 22Ω
S1-S3 = 1.09.01.0003: 6×6×5.0mm,黑色,SMD,,*; 名称: 轻触按键; 贴片和直插: SMT; 物料代码: 1.09.01.0003; 型号: 6×6×5.0mm,黑色,SMD; ComponentLink1Description: ErpDataInfo; ComponentLink1URL: http://erp.zlgmcu.com/ErpExt/ErpData/ListMateriel.aspx?pkey=1.09.01.0003
U7 = 1.05.10.0361: ESD单向; 名称: IC; 规格型号: PESD3V3S2UT,SOT-23,NXP,RoHS; 设备封装名称: SOT-23_PESD3V3S2UT; 厂商: NXP; 贴片和直插: SMT; PCB备注: 没有数据手册; 现有库存: 5276; 物料代码: 1.05.10.0361; 封装: SOT-23; RoHS: RoHS; ComponentLink1Description: ErpDataInfo; ComponentLink1URL: http://erp.zlgmcu.com/ErpExt/ErpData/ListMateriel.aspx?pkey=1.05.10.0361

## Sheet 12. JTAG.SchDoc
size A4; CheckedBy: 黄钦宁; Author: 陈坤; DocumentNumber: 12; SheetNumber: 12; SheetTotal: 13; PageSetup: Record=PageOptions|CenterHorizontal=True|CenterVertical=True|PrintScale=1.00|XCorrection=1.00|YCorrection=1.00|PrintKind=0|BorderSize=5000000|LeftOffset=0|BottomOffset=0|Orientation=2|PaperLength=1000|PaperWidth=1000|Scale=100|PaperSource=7|PrintQuality=600|MediaType=1|DitherType=10|PaperKind=A4|PrintScaleMode=1; DesignDate: 2013-08-16; CheckDate: 2013-12-28; SheetName: JTAG; SheetVersion: V1.00; SheetDescription: JTAG; ProductName: EasyARM-iMX28学习套件; ProductModel: EasyARM-iMX283
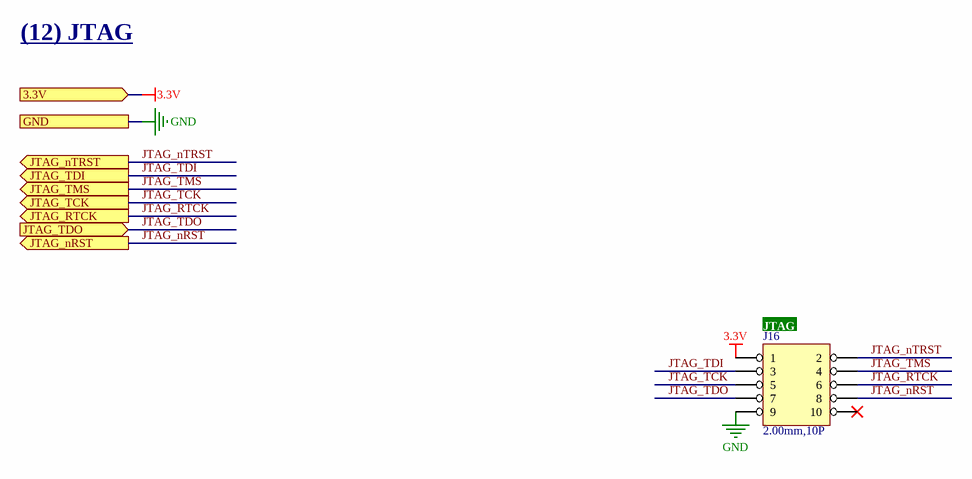
[diagram p11: 12. JTAG.SchDoc]

### Parts
J16  value 2.00mm,10P  [IDE-10-2.0]  (hidden comment: HEADER 5X2)

### Ports
3.3V, GND, JTAG_nRST (out), JTAG_nTRST (out), JTAG_RTCK (out), JTAG_TCK (out), JTAG_TDI (out), JTAG_TDO (in), JTAG_TMS (out)

### Nets
3.3V: J16.1 ; port 3.3V
GND: J16.9 ; port GND
JTAG_nRST: J16.8 ; port JTAG_nRST
JTAG_nTRST: J16.2 ; port JTAG_nTRST
JTAG_RTCK: J16.6 ; port JTAG_RTCK
JTAG_TCK: J16.5 ; port JTAG_TCK
JTAG_TDI: J16.3 ; port JTAG_TDI
JTAG_TDO: J16.7 ; port JTAG_TDO
JTAG_TMS: J16.4 ; port JTAG_TMS

Not connected (* = marked no-connect by the designer): J16 10*

### Notes on the sheet
- (12) JTAG
- (near J16) JTAG
- 1
- #
- 修改日期
- 修改内容
- 2
- 3
- 广州致远电子股份有限公司
- 设计人员
- 审核人员
- 设计日期
- 审核日期
- 产品名称
- 图纸名称
- 产品型号
- 图纸描述
- 图纸版本
- A4

### Library data of the parts
J16 = 1.10.04.0026: 2.00mm,10P,180°,黑色; 名称: 简易牛角座; 贴片和直插: THT; 物料代码: 1.10.04.0026; 型号: 2.00mm,10P,180°,黑色; ComponentLink1Description: ErpDataInfo; ComponentLink1URL: http://erp.zlgmcu.com/ErpExt/ErpData/ListMateriel.aspx?pkey=1.10.04.0026

## Sheet 04. BUZZER.SchDoc
size A4; CheckedBy: 黄钦宁; Author: 陈坤; DocumentNumber: 4; SheetNumber: 4; SheetTotal: 13; PageSetup: Record=PageOptions|CenterHorizontal=True|CenterVertical=True|PrintScale=1.00|XCorrection=1.00|YCorrection=1.00|PrintKind=0|BorderSize=5000000|LeftOffset=0|BottomOffset=0|Orientation=2|PaperLength=1000|PaperWidth=1000|Scale=100|PaperSource=7|PrintQuality=600|MediaType=1|DitherType=10|PaperKind=A4|PrintScaleMode=1; DesignDate: 2013-08-16; CheckDate: 2013-12-28; SheetName: 3.3V NPN控制有源蜂鸣器; SheetVersion: V1.00; SheetDescription: 有源蜂鸣器,3.3V,高电平驱动,>2.0V鸣叫最大声,<1.2V彻底停止; ProductName: EasyARM-iMX28学习套件; ProductModel: EasyARM-iMX283
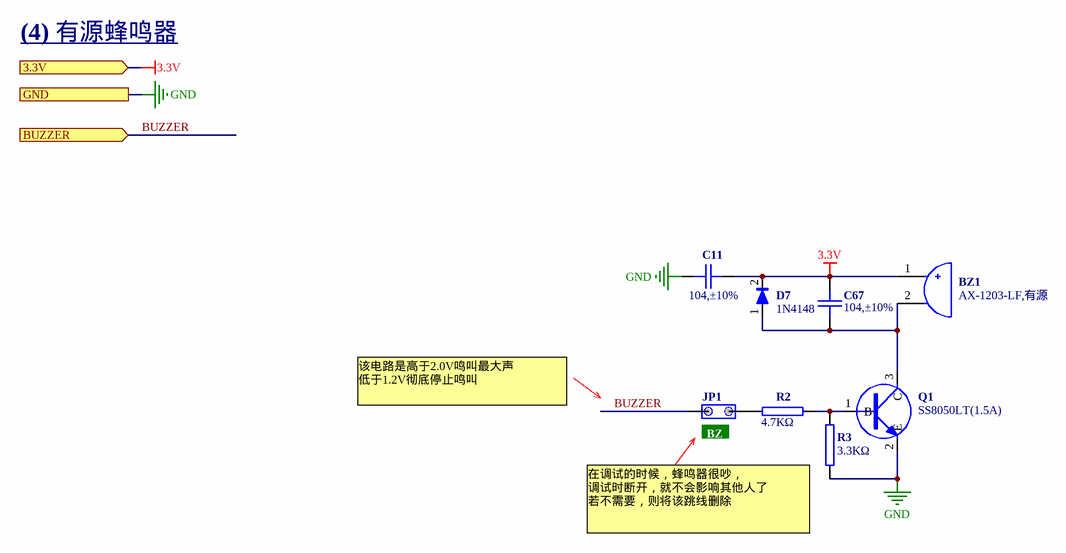
[diagram p12: 04. BUZZER.SchDoc]

### Parts
BZ1  value AX-1203-LF,有源  [BUZZ-.28/.46]  (hidden comment: BUZZER2)
C11  104,±10%  [0603C]
C67  104,±10%  [0603C]  (no BOM)
D7  value 1N4148  [SOD-323]  (hidden comment: DIODE1)  (no BOM)
JP1  120Ω_EN  [sip-2]  (value not drawn)
Q1  value SS8050LT(1.5A)  [SOT-23]  (hidden comment: NPN-1)
R2  4.7KΩ  [0603R]
R3  3.3KΩ  [0603R]

### Ports
3.3V, BUZZER (in), GND

### Nets
3.3V: BZ1.1(A) C11.1 C67.2 D7.2 ; port 3.3V
GND: C11.2 Q1.2(E) R3.1 ; port GND
BUZZER: JP1.1 ; port BUZZER  [project net BEEP]
NetBZ1_2: BZ1.2(B) C67.1 D7.1 Q1.3(C)
NetJP1_2: JP1.2 R2.1
NetQ1_1: Q1.1(B) R2.2 R3.2

### Notes on the sheet
- (4) 有源蜂鸣器
- 该电路是高于2.0V鸣叫最大声
  低于1.2V彻底停止鸣叫
- (near JP1) BZ
- (near R3) 在调试的时候，蜂鸣器很吵，
  调试时断开，就不会影响其他人了
  若不需要，则将该跳线删除
- 1
- #
- 修改日期
- 修改内容
- 2
- 3
- 广州致远电子股份有限公司
- 设计人员
- 审核人员
- 设计日期
- 审核日期
- 产品名称
- 图纸名称
- 产品型号
- 图纸描述
- 图纸版本
- A4

### Library data of the parts
BZ1 = 1.06.09.0013: AX-1203-LF,有源,Φ12×7.5mm,,常州笠翔,RoHS; 名称: 讯响器; 贴片和直插: THT; 器件优选方案: 优先选用; 物料代码: 1.06.09.0013; 厂商: 常州笠翔; RoHS: RoHS; 型号: AX-1203-LF,有源,Φ12×7.5mm; ComponentLink1Description: ErpDataInfo; ComponentLink1URL: http://erp.zlgmcu.com/ErpExt/ErpData/ListMateriel.aspx?pkey=1.06.09.0013
C11 C67 = 1.02.01.0032: as C56 on sheet 13. Others; 物料代码: 1.02.01.0032; Value: 104,±10%; RoHS: RoHS; 型号: 104,±10%,50V,X7R; ComponentLink1Description: ErpDataInfo; ComponentLink1URL: http://erp.zlgmcu.com/ErpExt/ErpData/ListMateriel.aspx?pkey=1.02.01.0032
D7 = 1.04.07.0027: 1N4148,SOD-323,RoHS; 名称: 二极管; 设备封装名称: SOD-323_1N4148; 贴片和直插: SMT; 物料代码: 1.04.07.0027; 封装: SOD-323; RoHS: RoHS; 型号: 1N4148; ComponentLink1Description: ErpDataInfo; ComponentLink1URL: http://erp.zlgmcu.com/ErpExt/ErpData/ListMateriel.aspx?pkey=1.04.07.0027
JP1 = JMP2
Q1 = 1.04.09.0001: SS8050LT(1.5A),SOT-23,江苏长电,RoHS; 名称: 三极管; 设备封装名称: SOT-23_SS8050LT; 贴片和直插: SMT; 物料代码: 1.04.09.0001; 封装: SOT-23; 厂商: 江苏长电; RoHS: RoHS; 型号: SS8050LT(1.5A); ComponentLink1Description: ErpDataInfo; ComponentLink1URL: http://erp.zlgmcu.com/ErpExt/ErpData/ListMateriel.aspx?pkey=1.04.09.0001
R2 = 1.01.01.0045: 4.7KΩ,0603,*,RoHS; 名称: 电阻; 封装: 0603; 设备封装名称: R0603_4.7K; 贴片和直插: SMT; 物料代码: 1.01.01.0045; Value: 4.7KΩ; RoHS: RoHS; 型号: 4.7KΩ; ComponentLink1Description: ErpDataInfo; ComponentLink1URL: http://erp.zlgmcu.com/ErpExt/ErpData/ListMateriel.aspx?pkey=1.01.01.0045
R3 = 1.01.01.0043: 3.3KΩ,0603,*,RoHS; 名称: 电阻; 封装: 0603; 设备封装名称: R0603_3.3K; 贴片和直插: SMT; 物料代码: 1.01.01.0043; Value: 3.3KΩ; RoHS: RoHS; 型号: 3.3KΩ; ComponentLink1Description: ErpDataInfo; ComponentLink1URL: http://erp.zlgmcu.com/ErpExt/ErpData/ListMateriel.aspx?pkey=1.01.01.0043

## Nets that join several sheets
3.3V: 05. UART (C12.1 U2.16), 07. USB OTG (R19.2 R20.2 R21.2), 09. NET_Interface (12 pins), 08. NET_DP83848K (20 pins), 10. TF Card (9 pins), 11. LCD (5 pins), 03. Power (8 pins), 13. Others (5 pins), 12. JTAG (J16.1), 04. BUZZER (BZ1.1 C11.1 C67.2 D7.2)
4.2V: 01. Main (R68.1), 03. Power (6 pins)
5V: 01. Main (JP7.1 R1.1), 07. USB OTG (C28.1 C29.1 U3.7), 11. LCD (C49.1 C50.1 J14.1 J14.2), 03. Power (14 pins)
5V_M283: 01. Main (JP7.2 R1.2), 02. M283 (J1.2 J1.3)
EARTH: 05. UART (C17.2 J7.10 J7.11 R4.1), 07. USB OTG (6 pins), 06. USB HOST (C27.2 J11.5 J11.6 R16.2), 09. NET_Interface (7 pins), 10. TF Card (10 pins)
GND: 02. M283 (19 pins), 05. UART (7 pins), 07. USB OTG (14 pins), 06. USB HOST (8 pins), 09. NET_Interface (6 pins), 08. NET_DP83848K (27 pins), 10. TF Card (9 pins), 11. LCD (30 pins), 03. Power (23 pins), 13. Others (11 pins), 12. JTAG (J16.9), 04. BUZZER (C11.2 Q1.2 R3.1)
USB_H_5V: 07. USB OTG (C32.1 C33.2 U3.5), 06. USB HOST (C25.1 C26.1 D5.4 J11.1)
VBAT: 01. Main (R68.2), 02. M283 (J1.4 J1.5), 03. Power (J4.1 TP4.1)
VDD_XTAL: 02. M283 (J1.41), 13. Others (S3.2 S3.3)
ADC0: 02. M283 (J1.37), 13. Others (J15.11)
ADC1: 02. M283 (J1.38), 13. Others (J15.12)
ADC6: 02. M283 (J1.39), 13. Others (J15.13)
AUART0_RX: 02. M283 (J1.106), 05. UART (J9.1)
AUART0_TX: 02. M283 (J1.105), 05. UART (J9.2)
AUART1_RX: 02. M283 (J1.110), 05. UART (J9.5)
AUART1_TX: 02. M283 (J1.109), 05. UART (J9.6)
AUART2_RX: 02. M283 (J1.104), 05. UART (J6.3)
AUART2_TX: 02. M283 (J1.103), 05. UART (J6.4)
AUART3_RX: 02. M283 (J1.112), 05. UART (J6.1)
AUART3_TX: 02. M283 (J1.111), 05. UART (J6.2)
BEEP: 02. M283 (J1.13), 04. BUZZER (JP1.1)
BOOT_MODE: 02. M283 (J1.17), 13. Others (JP2.1)
BOOT_SELECT: 02. M283 (J1.16), 13. Others (JP3.1)
CAN0_RX: 02. M283 (J1.125), 13. Others (J17.2)
CAN0_TX: 02. M283 (J1.124), 13. Others (J17.1)
CAN1_RX: 02. M283 (J1.123), 13. Others (J17.4)
CAN1_TX: 02. M283 (J1.122), 13. Others (J17.3)
CLR_REG: 02. M283 (J1.12), 13. Others (JP5.1)
DUART_RX: 02. M283 (J1.108), 05. UART (U2.9)
DUART_TX: 02. M283 (J1.107), 05. UART (U2.10)
ENET0_RX_DV: 02. M283 (J1.92), 08. NET_DP83848K (R37.1 U8.32)
ENET0_RXD0: 02. M283 (J1.90), 08. NET_DP83848K (R43.2 R49.1 U8.36)
ENET0_RXD1: 02. M283 (J1.89), 08. NET_DP83848K (R42.2 R48.1 U8.37)
ENET0_TX_EN: 02. M283 (J1.88), 08. NET_DP83848K (U8.3)
ENET0_TXD0: 02. M283 (J1.86), 08. NET_DP83848K (U8.4)
ENET0_TXD1: 02. M283 (J1.85), 08. NET_DP83848K (U8.5)
ENET_CLK: 02. M283 (J1.93), 08. NET_DP83848K (T2.1 U8.28 X1.3)
ENET_MDC: 02. M283 (J1.94), 08. NET_DP83848K (U8.25)
ENET_MDIO: 02. M283 (J1.95), 08. NET_DP83848K (R38.1 U8.24)
ENET_nRST: 02. M283 (J1.8), 08. NET_DP83848K (C63.2 R44.2 U8.23)
ERR: 02. M283 (J1.15), 13. Others (R32.1)
Factory: 02. M283 (J1.11), 13. Others (JP4.1)
GPIO1_17: 02. M283 (J1.9), 05. UART (J9.3)
GPIO1_18: 02. M283 (J1.10), 05. UART (J9.4)
GPIO1_28: 02. M283 (J1.114), 13. Others (J8.4)
GPIO1_29: 02. M283 (J1.115), 13. Others (J8.3)
GPIO1_30: 02. M283 (J1.116), 13. Others (J8.2)
GPIO1_31: 02. M283 (J1.117), 13. Others (J8.1)
GPIO2_4: 02. M283 (J1.56), 13. Others (J15.14)
GPIO2_5: 02. M283 (J1.57), 13. Others (J15.15)
GPIO2_6: 02. M283 (J1.58), 13. Others (J15.16)
GPIO2_7: 02. M283 (J1.59), 13. Others (J15.17)
GPIO2_12: 02. M283 (J1.27), 13. Others (J8.8)
GPIO2_13: 02. M283 (J1.26), 13. Others (J8.7)
GPIO2_14: 02. M283 (J1.25), 13. Others (J8.6)
GPIO2_15: 02. M283 (J1.24), 13. Others (J8.5)
GPIO3_6: 02. M283 (J1.34), 13. Others (J8.15)
GPIO3_7: 02. M283 (J1.33), 13. Others (J8.14)
GPIO3_10: 02. M283 (J1.32), 13. Others (J8.13)
GPIO3_11: 02. M283 (J1.31), 13. Others (J8.12)
GPIO3_14: 02. M283 (J1.30), 13. Others (J8.11)
GPIO3_15: 02. M283 (J1.29), 13. Others (J8.10)
GPIO3_27: 02. M283 (J1.28), 13. Others (J8.9)
HSADC: 02. M283 (J1.36), 13. Others (J15.10)
I2C1_SCL: 02. M283 (J1.119), 13. Others (J15.19)
I2C1_SDA: 02. M283 (J1.120), 13. Others (J15.20)
I2S_BITCLK: 02. M283 (J1.101), 13. Others (J15.3)
I2S_LRCLK: 02. M283 (J1.99), 13. Others (J15.2)
I2S_MCLK: 02. M283 (J1.100), 13. Others (J15.1)
I2S_RXD: 02. M283 (J1.97), 13. Others (J15.5)
I2S_TXD: 02. M283 (J1.98), 13. Others (J15.4)
JTAG_nTRST: 02. M283 (J1.23), 12. JTAG (J16.2)
JTAG_RTCK: 02. M283 (J1.19), 12. JTAG (J16.6)
JTAG_TCK: 02. M283 (J1.20), 12. JTAG (J16.5)
JTAG_TDI: 02. M283 (J1.22), 12. JTAG (J16.3)
JTAG_TDO: 02. M283 (J1.18), 12. JTAG (J16.7)
JTAG_TMS: 02. M283 (J1.21), 12. JTAG (J16.4)
NET_LINK_LED: 09. NET_Interface (R10.1), 08. NET_DP83848K (R51.2 R56.1 U8.22)
NET_RXD_N: 09. NET_Interface (R8.2 T1.8), 08. NET_DP83848K (U8.11)
NET_RXD_P: 09. NET_Interface (R7.1 T1.6), 08. NET_DP83848K (U8.12)
NET_SPEED_LED: 09. NET_Interface (R9.1), 08. NET_DP83848K (R54.2 R59.1 U8.21)
NET_TXD_N: 09. NET_Interface (R6.2 T1.3), 08. NET_DP83848K (U8.14)
NET_TXD_P: 09. NET_Interface (R5.2 T1.1), 08. NET_DP83848K (U8.15)
nRST: 02. M283 (J1.45), 13. Others (C55.1 R67.1)
PSWITCH: 02. M283 (J1.42), 13. Others (C56.2 R33.2 S2.2 S2.3)
RUN: 02. M283 (J1.14), 13. Others (R35.1)
SD_CLK: 02. M283 (J1.50), 10. TF Card (C42.1 J13.5 U4.1)
SD_CMD: 02. M283 (J1.51), 10. TF Card (J13.3 R65.1 U4.4)
SD_D0: 02. M283 (J1.52), 10. TF Card (J13.7 R61.1 U5.6)
SD_D1: 02. M283 (J1.53), 10. TF Card (J13.8 R62.1 U5.1)
SD_D2: 02. M283 (J1.54), 10. TF Card (J13.1 R63.1 U4.6)
SD_D3: 02. M283 (J1.55), 10. TF Card (J13.2 R64.1 U4.5)
SD_DETECT: 02. M283 (J1.49), 10. TF Card (R28.1 R66.1 U5.5)
SD_nWP: 02. M283 (J1.48), 10. TF Card (R29.2)
SPI2_MISO: 02. M283 (J1.63), 13. Others (J15.9)
SPI2_MOSI: 02. M283 (J1.62), 13. Others (J15.6)
SPI2_SCK: 02. M283 (J1.61), 13. Others (J15.7)
SPI2_SS0: 02. M283 (J1.64), 13. Others (J15.8)
SPI3_MISO: 02. M283 (J1.67), 13. Others (J17.7)
SPI3_MOSI: 02. M283 (J1.66), 13. Others (J17.6)
SPI3_SCK: 02. M283 (J1.65), 13. Others (J17.5)
SPI3_SS0: 02. M283 (J1.68), 13. Others (J17.8)
TFT_D0: 02. M283 (J1.139), 11. LCD (RP5.4)
TFT_D1: 02. M283 (J1.140), 11. LCD (RP4.1)
TFT_D2: 02. M283 (J1.141), 11. LCD (RP4.2)
TFT_D3: 02. M283 (J1.142), 11. LCD (RP4.3)
TFT_D4: 02. M283 (J1.143), 11. LCD (RP4.4)
TFT_D5: 02. M283 (J1.144), 11. LCD (RP7.2)
TFT_D6: 02. M283 (J1.145), 11. LCD (RP7.3)
TFT_D7: 02. M283 (J1.146), 11. LCD (RP7.4)
TFT_D8: 02. M283 (J1.147), 11. LCD (RP5.1)
TFT_D9: 02. M283 (J1.148), 11. LCD (RP5.2)
TFT_D10: 02. M283 (J1.149), 11. LCD (RP5.3)
TFT_D11: 02. M283 (J1.150), 11. LCD (RP8.1)
TFT_D12: 02. M283 (J1.151), 11. LCD (RP8.2)
TFT_D13: 02. M283 (J1.152), 11. LCD (RP8.3)
TFT_D14: 02. M283 (J1.153), 11. LCD (RP8.4)
TFT_D15: 02. M283 (J1.154), 11. LCD (RP7.1)
TFT_HSYNC: 02. M283 (J1.137), 11. LCD (RP3.2)
TFT_nRST: 02. M283 (J1.133), 11. LCD (J14.18)
TFT_PWM: 02. M283 (J1.132), 11. LCD (J14.17)
TFT_VCLK: 02. M283 (J1.135), 11. LCD (RP3.4)
TFT_VDEN: 02. M283 (J1.136), 11. LCD (RP3.3)
TFT_VSYNC: 02. M283 (J1.138), 11. LCD (RP3.1)
TS_XM: 02. M283 (J1.127), 11. LCD (C54.1 RP6.4)
TS_XP: 02. M283 (J1.128), 11. LCD (C53.1 RP6.3)
TS_YM: 02. M283 (J1.129), 11. LCD (C52.1 RP6.2)
TS_YP: 02. M283 (J1.130), 11. LCD (C51.1 RP6.1)
USB_H_N: 02. M283 (J1.75), 06. USB HOST (R14.2)
USB_H_OC: 02. M283 (J1.77), 07. USB OTG (R19.1 U3.4)
USB_H_P: 02. M283 (J1.76), 06. USB HOST (R15.2)
USB_OTG_ID: 02. M283 (J1.74), 07. USB OTG (ESD1.1 ESD1.2 J12.4)
USB_OTG_N: 02. M283 (J1.72), 07. USB OTG (R26.2)
USB_OTG_OC: 02. M283 (J1.70), 07. USB OTG (R21.1 U3.2)
USB_OTG_P: 02. M283 (J1.73), 07. USB OTG (R25.2)
USB_OTG_PWR: 02. M283 (J1.71), 07. USB OTG (R22.2 U3.1)
WDO_EN: 02. M283 (J1.43), 13. Others (JP6.1)